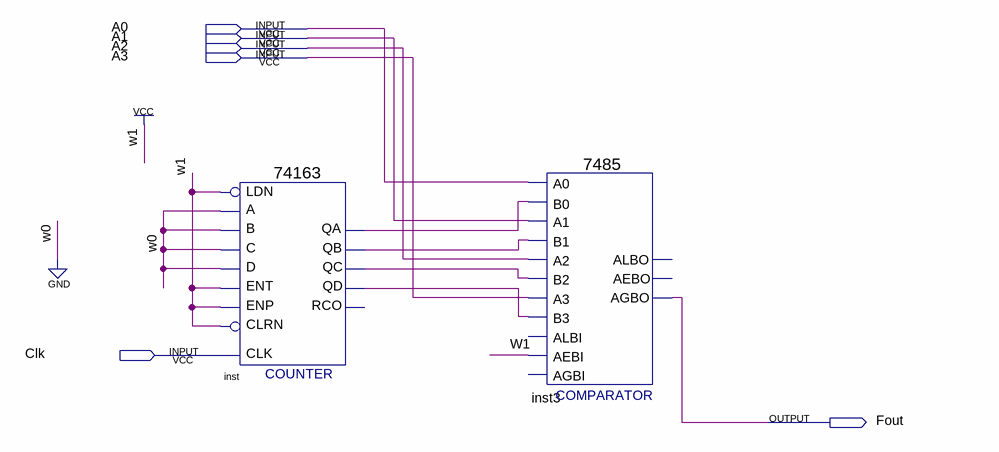
[diagram p0: schematic sheet]
// Quartus schematic Project.bdf as structural Verilog: 2 symbols, 6 pins
module Project (
  input  A0,
  input  A1,
  input  A2,
  input  A3,
  input  Clk,
  output Fout
);

  wire inst_qa, inst_qb, inst_qc, inst_qd;

  \74163  inst (
    .C(1'b0), .B(1'b0), .A(1'b0), .ENT(1'b1), .D(1'b0), .CLRN(1'b1), .CLK(Clk), .ENP(1'b1), .LDN(1'b1),
    .QA(inst_qa), .QB(inst_qb), .QC(inst_qc), .QD(inst_qd));  // open: RCO
  \7485  inst3 (
    .A3(A3), .B2(inst_qc), .A2(A2), .AEBI(1'b1), .A0(A0), .B0(inst_qa), .B3(inst_qd), .A1(A1), .B1(inst_qb),
    .AGBO(Fout));  // open: AGBI, ALBI, ALBO, AEBO
endmodule
